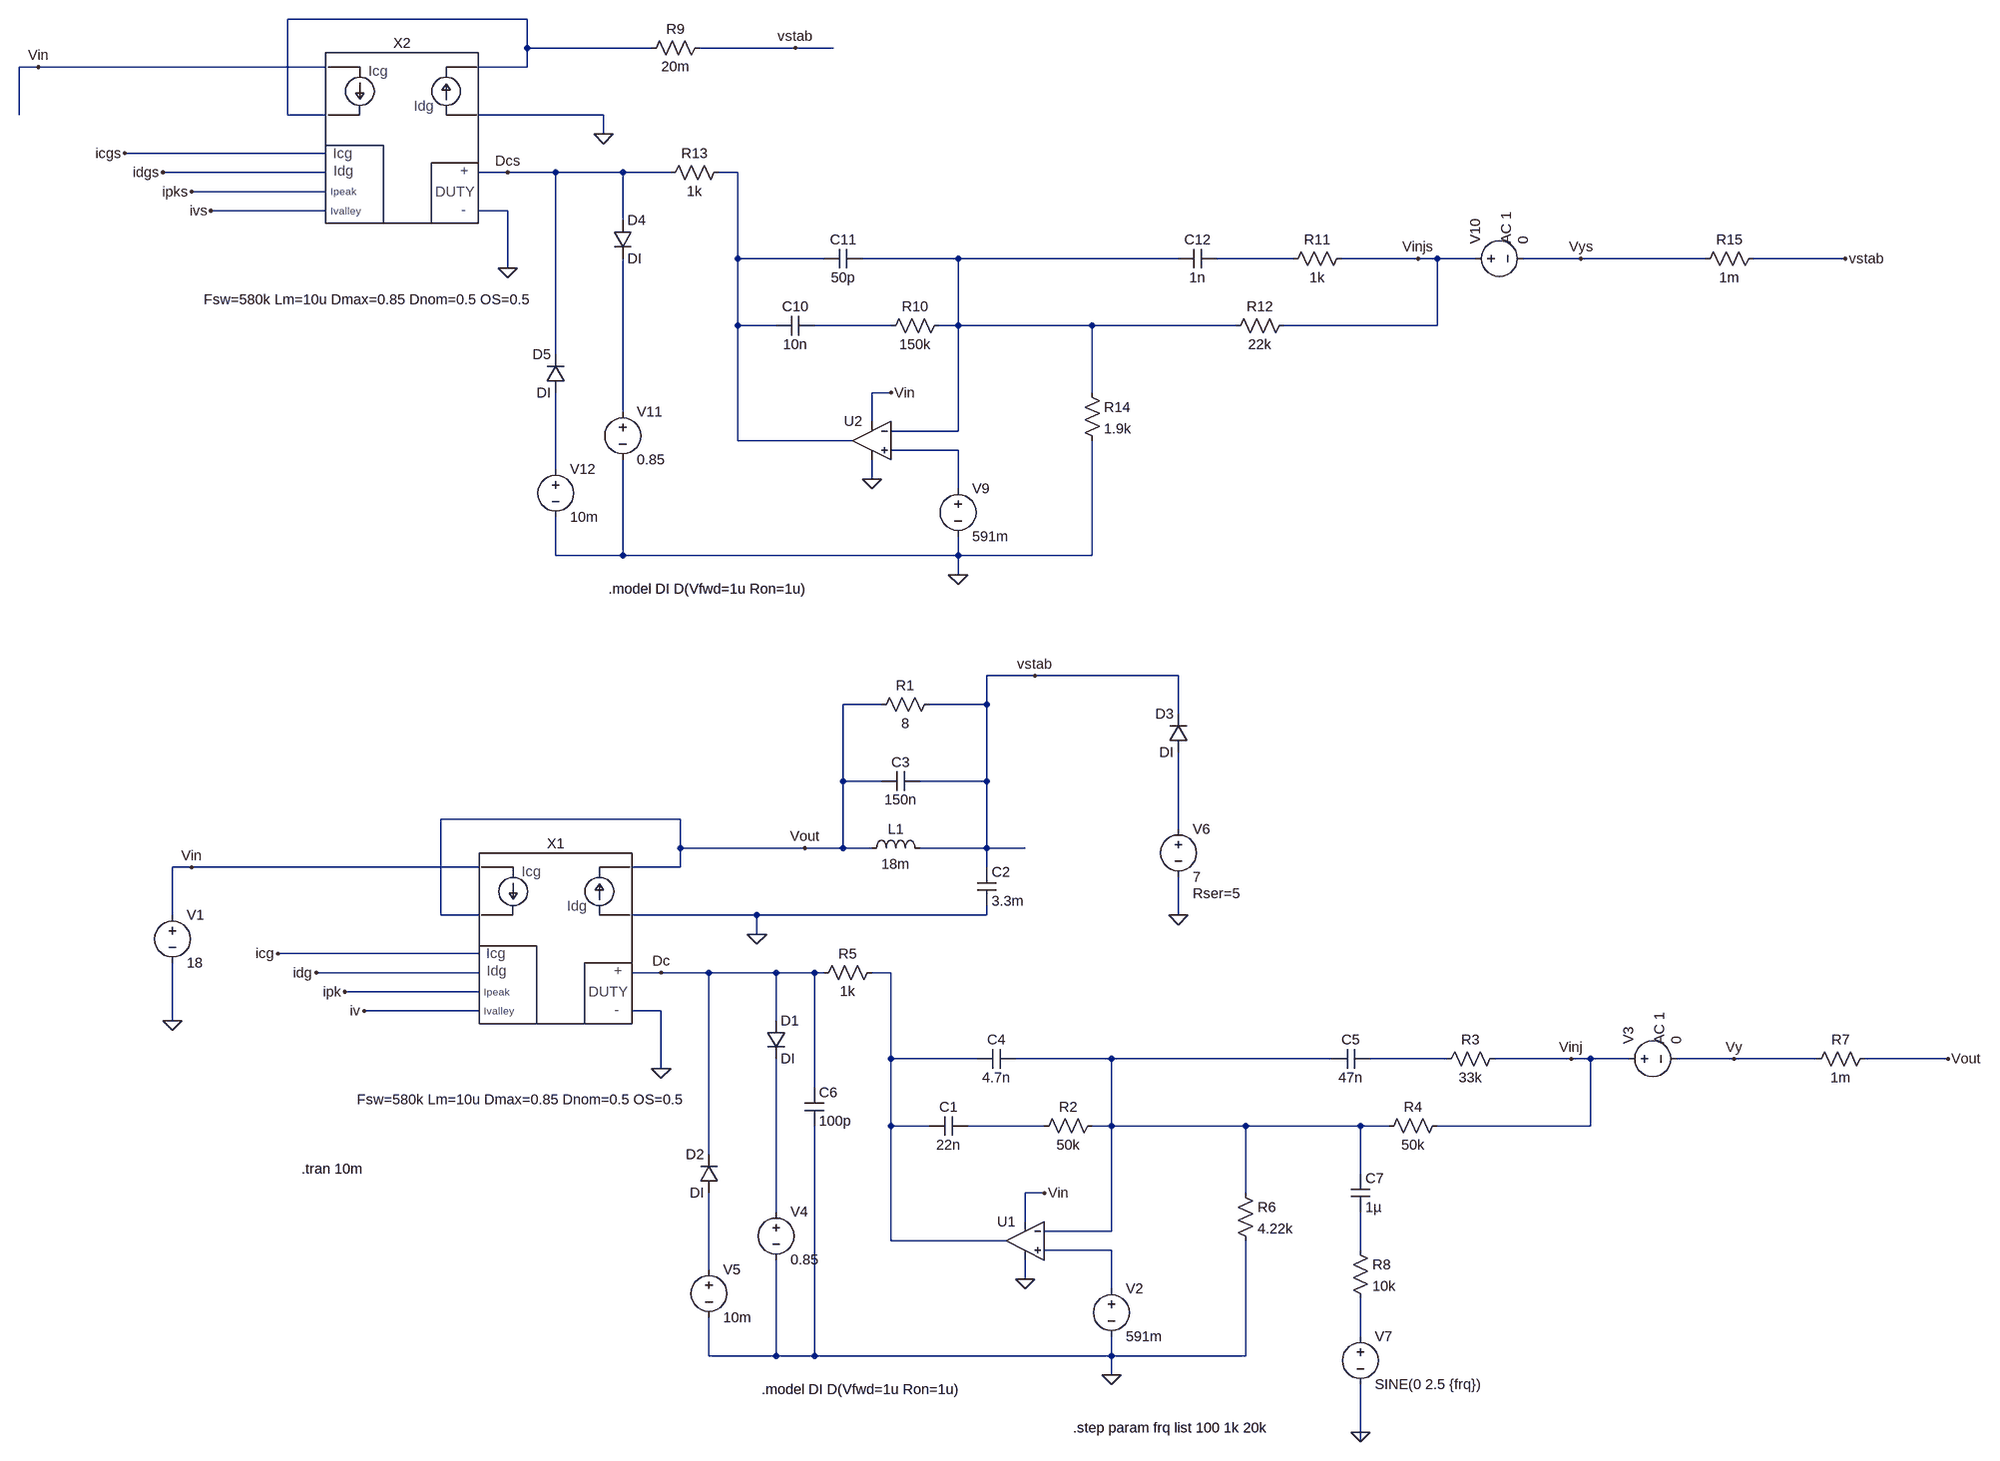
[diagram p0: schematic TPS40195_Reference_Trans.asc]
TPS40195_Reference_Trans.asc, the LTspice schematic file:
Version 4
SHEET 1 2744 1032
WIRE 144 -2528 -256 -2528
WIRE 144 -2480 144 -2528
WIRE 352 -2480 144 -2480
WIRE 592 -2480 432 -2480
WIRE 656 -2480 592 -2480
WIRE -672 -2448 -704 -2448
WIRE -192 -2448 -672 -2448
WIRE 144 -2448 144 -2480
WIRE 144 -2448 64 -2448
WIRE -704 -2368 -704 -2448
WIRE -256 -2368 -256 -2528
WIRE -192 -2368 -256 -2368
WIRE 272 -2368 64 -2368
WIRE 272 -2336 272 -2368
WIRE -192 -2304 -528 -2304
WIRE -192 -2272 -464 -2272
WIRE 112 -2272 64 -2272
WIRE 192 -2272 112 -2272
WIRE 304 -2272 192 -2272
WIRE 384 -2272 304 -2272
WIRE 496 -2272 464 -2272
WIRE -192 -2240 -416 -2240
WIRE -192 -2208 -384 -2208
WIRE 112 -2208 64 -2208
WIRE 304 -2192 304 -2272
WIRE 496 -2128 496 -2272
WIRE 640 -2128 496 -2128
WIRE 864 -2128 704 -2128
WIRE 1232 -2128 864 -2128
WIRE 1424 -2128 1296 -2128
WIRE 1632 -2128 1504 -2128
WIRE 1664 -2128 1632 -2128
WIRE 1728 -2128 1664 -2128
WIRE 1904 -2128 1808 -2128
WIRE 2112 -2128 1904 -2128
WIRE 2416 -2128 2192 -2128
WIRE 112 -2112 112 -2208
WIRE 496 -2016 496 -2128
WIRE 560 -2016 496 -2016
WIRE 752 -2016 624 -2016
WIRE 864 -2016 864 -2128
WIRE 864 -2016 832 -2016
WIRE 1088 -2016 864 -2016
WIRE 1328 -2016 1088 -2016
WIRE 1664 -2016 1664 -2128
WIRE 1664 -2016 1408 -2016
WIRE 192 -1968 192 -2272
WIRE 752 -1904 720 -1904
WIRE 1088 -1904 1088 -2016
WIRE 304 -1872 304 -2128
WIRE 720 -1856 720 -1904
WIRE 864 -1840 864 -2016
WIRE 864 -1840 752 -1840
WIRE 496 -1824 496 -2016
WIRE 688 -1824 496 -1824
WIRE 864 -1808 752 -1808
WIRE 192 -1776 192 -1904
WIRE 720 -1760 720 -1792
WIRE 864 -1744 864 -1808
WIRE 192 -1632 192 -1696
WIRE 304 -1632 304 -1792
WIRE 304 -1632 192 -1632
WIRE 864 -1632 864 -1664
WIRE 864 -1632 304 -1632
WIRE 1088 -1632 1088 -1824
WIRE 1088 -1632 864 -1632
WIRE 864 -1600 864 -1632
WIRE 992 -256 912 -256
WIRE 1232 -256 992 -256
WIRE 736 -208 672 -208
WIRE 912 -208 912 -256
WIRE 912 -208 816 -208
WIRE 1232 -192 1232 -256
WIRE 672 -80 672 -208
WIRE 736 -80 672 -80
WIRE 912 -80 912 -208
WIRE 912 -80 800 -80
WIRE 400 -16 0 -16
WIRE 1232 0 1232 -128
WIRE 400 32 400 -16
WIRE 608 32 400 32
WIRE 672 32 672 -80
WIRE 672 32 608 32
WIRE 720 32 672 32
WIRE 912 32 912 -80
WIRE 912 32 800 32
WIRE 976 32 912 32
WIRE -416 64 -448 64
WIRE 64 64 -416 64
WIRE 400 64 400 32
WIRE 400 64 320 64
WIRE 912 64 912 32
WIRE -448 144 -448 64
WIRE 0 144 0 -16
WIRE 64 144 0 144
WIRE 528 144 320 144
WIRE 912 144 912 128
WIRE 912 144 528 144
WIRE 1232 144 1232 80
WIRE 528 176 528 144
WIRE 64 208 -272 208
WIRE 64 240 -208 240
WIRE 368 240 320 240
WIRE 448 240 368 240
WIRE 560 240 448 240
WIRE 624 240 560 240
WIRE 640 240 624 240
WIRE 752 240 720 240
WIRE 64 272 -160 272
WIRE 64 304 -128 304
WIRE 368 304 320 304
WIRE -448 320 -448 224
WIRE 560 320 560 240
WIRE 752 384 752 240
WIRE 896 384 752 384
WIRE 1120 384 960 384
WIRE 1488 384 1120 384
WIRE 1680 384 1552 384
WIRE 1888 384 1760 384
WIRE 1920 384 1888 384
WIRE 1984 384 1920 384
WIRE 2160 384 2064 384
WIRE 2368 384 2160 384
WIRE 2672 384 2448 384
WIRE 368 400 368 304
WIRE 624 432 624 240
WIRE 752 496 752 384
WIRE 816 496 752 496
WIRE 1008 496 880 496
WIRE 1120 496 1120 384
WIRE 1120 496 1088 496
WIRE 1344 496 1120 496
WIRE 1536 496 1344 496
WIRE 1584 496 1536 496
WIRE 1920 496 1920 384
WIRE 1920 496 1664 496
WIRE 448 544 448 240
WIRE 1536 576 1536 496
WIRE 1008 608 976 608
WIRE 1344 608 1344 496
WIRE 560 640 560 384
WIRE 976 656 976 608
WIRE 1120 672 1120 496
WIRE 1120 672 1008 672
WIRE 752 688 752 496
WIRE 944 688 752 688
WIRE 1120 704 1008 704
WIRE 1536 704 1536 640
WIRE 448 736 448 608
WIRE 976 752 976 720
WIRE 1120 768 1120 704
WIRE 1536 848 1536 784
WIRE 448 880 448 816
WIRE 560 880 560 720
WIRE 560 880 448 880
WIRE 624 880 624 496
WIRE 624 880 560 880
WIRE 1120 880 1120 848
WIRE 1120 880 624 880
WIRE 1344 880 1344 688
WIRE 1344 880 1120 880
WIRE 1120 912 1120 880
WIRE 1536 1008 1536 928
WIRE 1536 1024 1536 1008
FLAG 528 176 0
FLAG -448 320 0
FLAG 608 32 Vout
FLAG -416 64 Vin
FLAG 368 240 Dc
FLAG -272 208 icg
FLAG -208 240 idg
FLAG -160 272 ipk
FLAG -128 304 iv
FLAG 368 400 0
FLAG 976 752 0
FLAG 1008 608 Vin
FLAG 1120 912 0
FLAG 2672 384 Vout
FLAG 1888 384 Vinj
FLAG 1232 144 0
FLAG 2160 384 Vy
FLAG 1536 1008 0
FLAG 992 -256 vstab
FLAG 272 -2336 0
FLAG 592 -2480 vstab
FLAG -672 -2448 Vin
FLAG 112 -2272 Dcs
FLAG -528 -2304 icgs
FLAG -464 -2272 idgs
FLAG -416 -2240 ipks
FLAG -384 -2208 ivs
FLAG 112 -2112 0
FLAG 720 -1760 0
FLAG 752 -1904 Vin
FLAG 864 -1600 0
FLAG 2416 -2128 vstab
FLAG 1632 -2128 Vinjs
FLAG 1904 -2128 Vys
DATAFLAG -208 208 ""
DATAFLAG -112 240 ""
DATAFLAG -112 272 ""
DATAFLAG -32 304 ""
DATAFLAG 464 32 ""
DATAFLAG 976 32 ""
DATAFLAG 480 240 ""
DATAFLAG 1200 384 ""
DATAFLAG 784 384 ""
DATAFLAG -464 -2304 ""
DATAFLAG -368 -2272 ""
DATAFLAG -368 -2240 ""
DATAFLAG -288 -2208 ""
DATAFLAG 208 -2480 ""
DATAFLAG 224 -2272 ""
DATAFLAG 944 -2128 ""
DATAFLAG 528 -2128 ""
SYMBOL voltage -448 128 R0
WINDOW 123 0 0 Left 0
WINDOW 39 0 0 Left 0
SYMATTR InstName V1
SYMATTR Value 18
SYMBOL Duty_Control_IRM 192 144 R0
WINDOW 39 -332 308 Left 2
SYMATTR SpiceLine Fsw=580k Lm=10u Dmax=0.85 Dnom=0.5 OS=0.5
SYMATTR InstName X1
SYMBOL ind 704 48 R270
WINDOW 0 32 56 VTop 2
WINDOW 3 5 56 VBottom 2
SYMATTR InstName L1
SYMATTR Value 18m
SYMATTR SpiceLine Rser=6
SYMBOL cap 896 64 R0
SYMATTR InstName C2
SYMATTR Value 3.3m
SYMATTR SpiceLine Rser=20m
SYMBOL cap 800 -96 R90
WINDOW 0 0 32 VBottom 2
WINDOW 3 32 32 VTop 2
SYMATTR InstName C3
SYMATTR Value 150n
SYMBOL res 832 -224 R90
WINDOW 0 0 56 VBottom 2
WINDOW 3 32 56 VTop 2
SYMATTR InstName R1
SYMATTR Value 8
SYMBOL Opamps\\UniversalOpamp2 976 688 M0
SYMATTR InstName U1
SYMATTR Value2 Avol=1k GBW=7Meg Slew=10Meg
SYMATTR SpiceLine ilimit=25m rail=0 Vos=0 phimargin=68
SYMBOL voltage 1120 752 R0
WINDOW 123 0 0 Left 0
WINDOW 39 0 0 Left 0
SYMATTR InstName V2
SYMATTR Value 591m
SYMBOL cap 880 480 R90
WINDOW 0 0 32 VBottom 2
WINDOW 3 32 32 VTop 2
SYMATTR InstName C1
SYMATTR Value 22n
SYMBOL res 1104 480 R90
WINDOW 0 0 56 VBottom 2
WINDOW 3 32 56 VTop 2
SYMATTR InstName R2
SYMATTR Value 50k
SYMBOL cap 960 368 R90
WINDOW 0 0 32 VBottom 2
WINDOW 3 32 32 VTop 2
SYMATTR InstName C4
SYMATTR Value 4.7n
SYMBOL cap 1552 368 R90
WINDOW 0 0 32 VBottom 2
WINDOW 3 32 32 VTop 2
SYMATTR InstName C5
SYMATTR Value 47n
SYMBOL res 1776 368 R90
WINDOW 0 0 56 VBottom 2
WINDOW 3 32 56 VTop 2
SYMATTR InstName R3
SYMATTR Value 33k
SYMBOL res 1680 480 R90
WINDOW 0 0 56 VBottom 2
WINDOW 3 32 56 VTop 2
SYMATTR InstName R4
SYMATTR Value 50k
SYMBOL res 736 224 R90
WINDOW 0 0 56 VBottom 2
WINDOW 3 32 56 VTop 2
SYMATTR InstName R5
SYMATTR Value 1k
SYMBOL res 1328 592 R0
SYMATTR InstName R6
SYMATTR Value 4.22k
SYMBOL voltage 1968 384 R270
WINDOW 123 24 68 Left 2
WINDOW 39 0 0 Left 0
SYMATTR Value2 AC 1
SYMATTR InstName V3
SYMATTR Value 0
SYMBOL diode 544 320 R0
SYMATTR InstName D1
SYMATTR Value DI
SYMBOL voltage 560 624 R0
WINDOW 123 0 0 Left 0
WINDOW 39 0 0 Left 0
SYMATTR InstName V4
SYMATTR Value 0.85
SYMBOL diode 464 608 R180
WINDOW 0 24 64 Left 2
WINDOW 3 24 0 Left 2
SYMATTR InstName D2
SYMATTR Value DI
SYMBOL voltage 448 720 R0
WINDOW 123 0 0 Left 0
WINDOW 39 0 0 Left 0
SYMATTR InstName V5
SYMATTR Value 10m
SYMBOL diode 1248 -128 R180
WINDOW 0 24 64 Left 2
WINDOW 3 24 0 Left 2
SYMATTR InstName D3
SYMATTR Value DI
SYMBOL voltage 1232 -16 R0
WINDOW 123 0 0 Left 0
WINDOW 39 24 124 Left 2
SYMATTR SpiceLine Rser=5
SYMATTR InstName V6
SYMATTR Value 7
SYMBOL res 2464 368 R90
WINDOW 0 0 56 VBottom 2
WINDOW 3 32 56 VTop 2
SYMATTR InstName R7
SYMATTR Value 1m
SYMBOL voltage 1536 832 R0
WINDOW 123 0 0 Left 0
WINDOW 39 0 0 Left 0
SYMATTR InstName V7
SYMATTR Value SINE(0 2.5 {frq})
SYMBOL cap 608 432 R0
SYMATTR InstName C6
SYMATTR Value 100p
SYMBOL cap 1520 576 R0
SYMATTR InstName C7
SYMATTR Value 1µ
SYMBOL res 1520 688 R0
SYMATTR InstName R8
SYMATTR Value 10k
SYMBOL Duty_Control_IRM -64 -2368 R0
WINDOW 39 -332 308 Left 2
SYMATTR SpiceLine Fsw=580k Lm=10u Dmax=0.85 Dnom=0.5 OS=0.5
SYMATTR InstName X2
SYMBOL Opamps\\UniversalOpamp2 720 -1824 M0
SYMATTR InstName U2
SYMATTR Value2 Avol=1k GBW=7Meg Slew=10Meg
SYMATTR SpiceLine ilimit=25m rail=0 Vos=0 phimargin=68
SYMBOL voltage 864 -1760 R0
WINDOW 123 0 0 Left 0
WINDOW 39 0 0 Left 0
SYMATTR InstName V9
SYMATTR Value 591m
SYMBOL cap 624 -2032 R90
WINDOW 0 0 32 VBottom 2
WINDOW 3 32 32 VTop 2
SYMATTR InstName C10
SYMATTR Value 10n
SYMBOL res 848 -2032 R90
WINDOW 0 0 56 VBottom 2
WINDOW 3 32 56 VTop 2
SYMATTR InstName R10
SYMATTR Value 150k
SYMBOL cap 704 -2144 R90
WINDOW 0 0 32 VBottom 2
WINDOW 3 32 32 VTop 2
SYMATTR InstName C11
SYMATTR Value 50p
SYMBOL cap 1296 -2144 R90
WINDOW 0 0 32 VBottom 2
WINDOW 3 32 32 VTop 2
SYMATTR InstName C12
SYMATTR Value 1n
SYMBOL res 1520 -2144 R90
WINDOW 0 0 56 VBottom 2
WINDOW 3 32 56 VTop 2
SYMATTR InstName R11
SYMATTR Value 1k
SYMBOL res 1424 -2032 R90
WINDOW 0 0 56 VBottom 2
WINDOW 3 32 56 VTop 2
SYMATTR InstName R12
SYMATTR Value 22k
SYMBOL res 480 -2288 R90
WINDOW 0 0 56 VBottom 2
WINDOW 3 32 56 VTop 2
SYMATTR InstName R13
SYMATTR Value 1k
SYMBOL res 1072 -1920 R0
SYMATTR InstName R14
SYMATTR Value 1.9k
SYMBOL voltage 1712 -2128 R270
WINDOW 123 24 68 Left 2
WINDOW 39 0 0 Left 0
SYMATTR Value2 AC 1
SYMATTR InstName V10
SYMATTR Value 0
SYMBOL diode 288 -2192 R0
SYMATTR InstName D4
SYMATTR Value DI
SYMBOL voltage 304 -1888 R0
WINDOW 123 0 0 Left 0
WINDOW 39 0 0 Left 0
SYMATTR InstName V11
SYMATTR Value 0.85
SYMBOL diode 208 -1904 R180
WINDOW 0 24 64 Left 2
WINDOW 3 24 0 Left 2
SYMATTR InstName D5
SYMATTR Value DI
SYMBOL voltage 192 -1792 R0
WINDOW 123 0 0 Left 0
WINDOW 39 0 0 Left 0
SYMATTR InstName V12
SYMATTR Value 10m
SYMBOL res 2208 -2144 R90
WINDOW 0 0 56 VBottom 2
WINDOW 3 32 56 VTop 2
SYMATTR InstName R15
SYMATTR Value 1m
SYMBOL res 448 -2496 R90
WINDOW 0 0 56 VBottom 2
WINDOW 3 32 56 VTop 2
SYMATTR InstName R9
SYMATTR Value 20m
TEXT -232 568 Left 2 !.tran 10m
TEXT 536 936 Left 2 !.model DI D(Vfwd=1u Ron=1u)
TEXT 1056 1000 Left 2 !.step param frq list 100 1k 20k
TEXT 280 -1576 Left 2 !.model DI D(Vfwd=1u Ron=1u)

The netlist it stands for:
* TPS40195_Reference_Trans.asc
V1 Vin 0 18
XX1 Dc 0 Vin Vout Vout 0 icg idg ipk iv Duty_Control_IRM params: Fsw=580k Lm=10u Dmax=0.85 Dnom=0.5 OS=0.5  ; pins D+ D- Vcg+ Vcg- Vdg+ Vdg- Icharge Idischarge Ipeak Ivalley
L1 Vout vstab 18m Rser=6
C2 vstab 0 3.3m Rser=20m
C3 vstab Vout 150n
R1 vstab Vout 8
XU1 N015 N011 Vin 0 N010 level.2 Avol=1k GBW=7Meg Slew=10Meg ilimit=25m rail=0 Vos=0 phimargin=68 en=0 enk=0 in=0 ink=0 Rin=500Meg  ; pins IN+ IN- V+ V- OUT
V2 N015 0 591m
C1 N013 N010 22n
R2 N011 N013 50k
C4 N011 N010 4.7n
C5 N012 N011 47n
R3 Vinj N012 33k
R4 Vinj N011 50k
R5 N010 Dc 1k
R6 N011 0 4.22k
V3 Vinj Vy 0 AC 1
D1 Dc N014 DI
V4 N014 0 0.85
D2 N017 Dc DI
V5 N017 0 10m
D3 N009 vstab DI
V6 N009 0 7 Rser=5
R7 Vout Vy 1m
V7 N018 0 SINE(0 2.5 {frq})
C6 Dc 0 100p
C7 N011 N016 1µ
R8 N016 N018 10k
XX2 Dcs 0 Vin N001 N001 0 icgs idgs ipks ivs Duty_Control_IRM params: Fsw=580k Lm=10u Dmax=0.85 Dnom=0.5 OS=0.5  ; pins D+ D- Vcg+ Vcg- Vdg+ Vdg- Icharge Idischarge Ipeak Ivalley
XU2 N007 N003 Vin 0 N002 level.2 Avol=1k GBW=7Meg Slew=10Meg ilimit=25m rail=0 Vos=0 phimargin=68 en=0 enk=0 in=0 ink=0 Rin=500Meg  ; pins IN+ IN- V+ V- OUT
V9 N007 0 591m
C10 N005 N002 10n
R10 N003 N005 150k
C11 N003 N002 50p
C12 N004 N003 1n
R11 Vinjs N004 1k
R12 Vinjs N003 22k
R13 N002 Dcs 1k
R14 N003 0 1.9k
V10 Vinjs Vys 0 AC 1
D4 Dcs N006 DI
V11 N006 0 0.85
D5 N008 Dcs DI
V12 N008 0 10m
R15 vstab Vys 1m
R9 vstab N001 20m
.model D D
.lib standard.dio
.tran 10m
.model DI D(Vfwd=1u Ron=1u)
.step param frq list 100 1k 20k
.model DI D(Vfwd=1u Ron=1u)
.lib UniversalOpamps2.sub
.backanno
.end